# Altium schematic sheet MainBoard_Top.SchDoc
size C
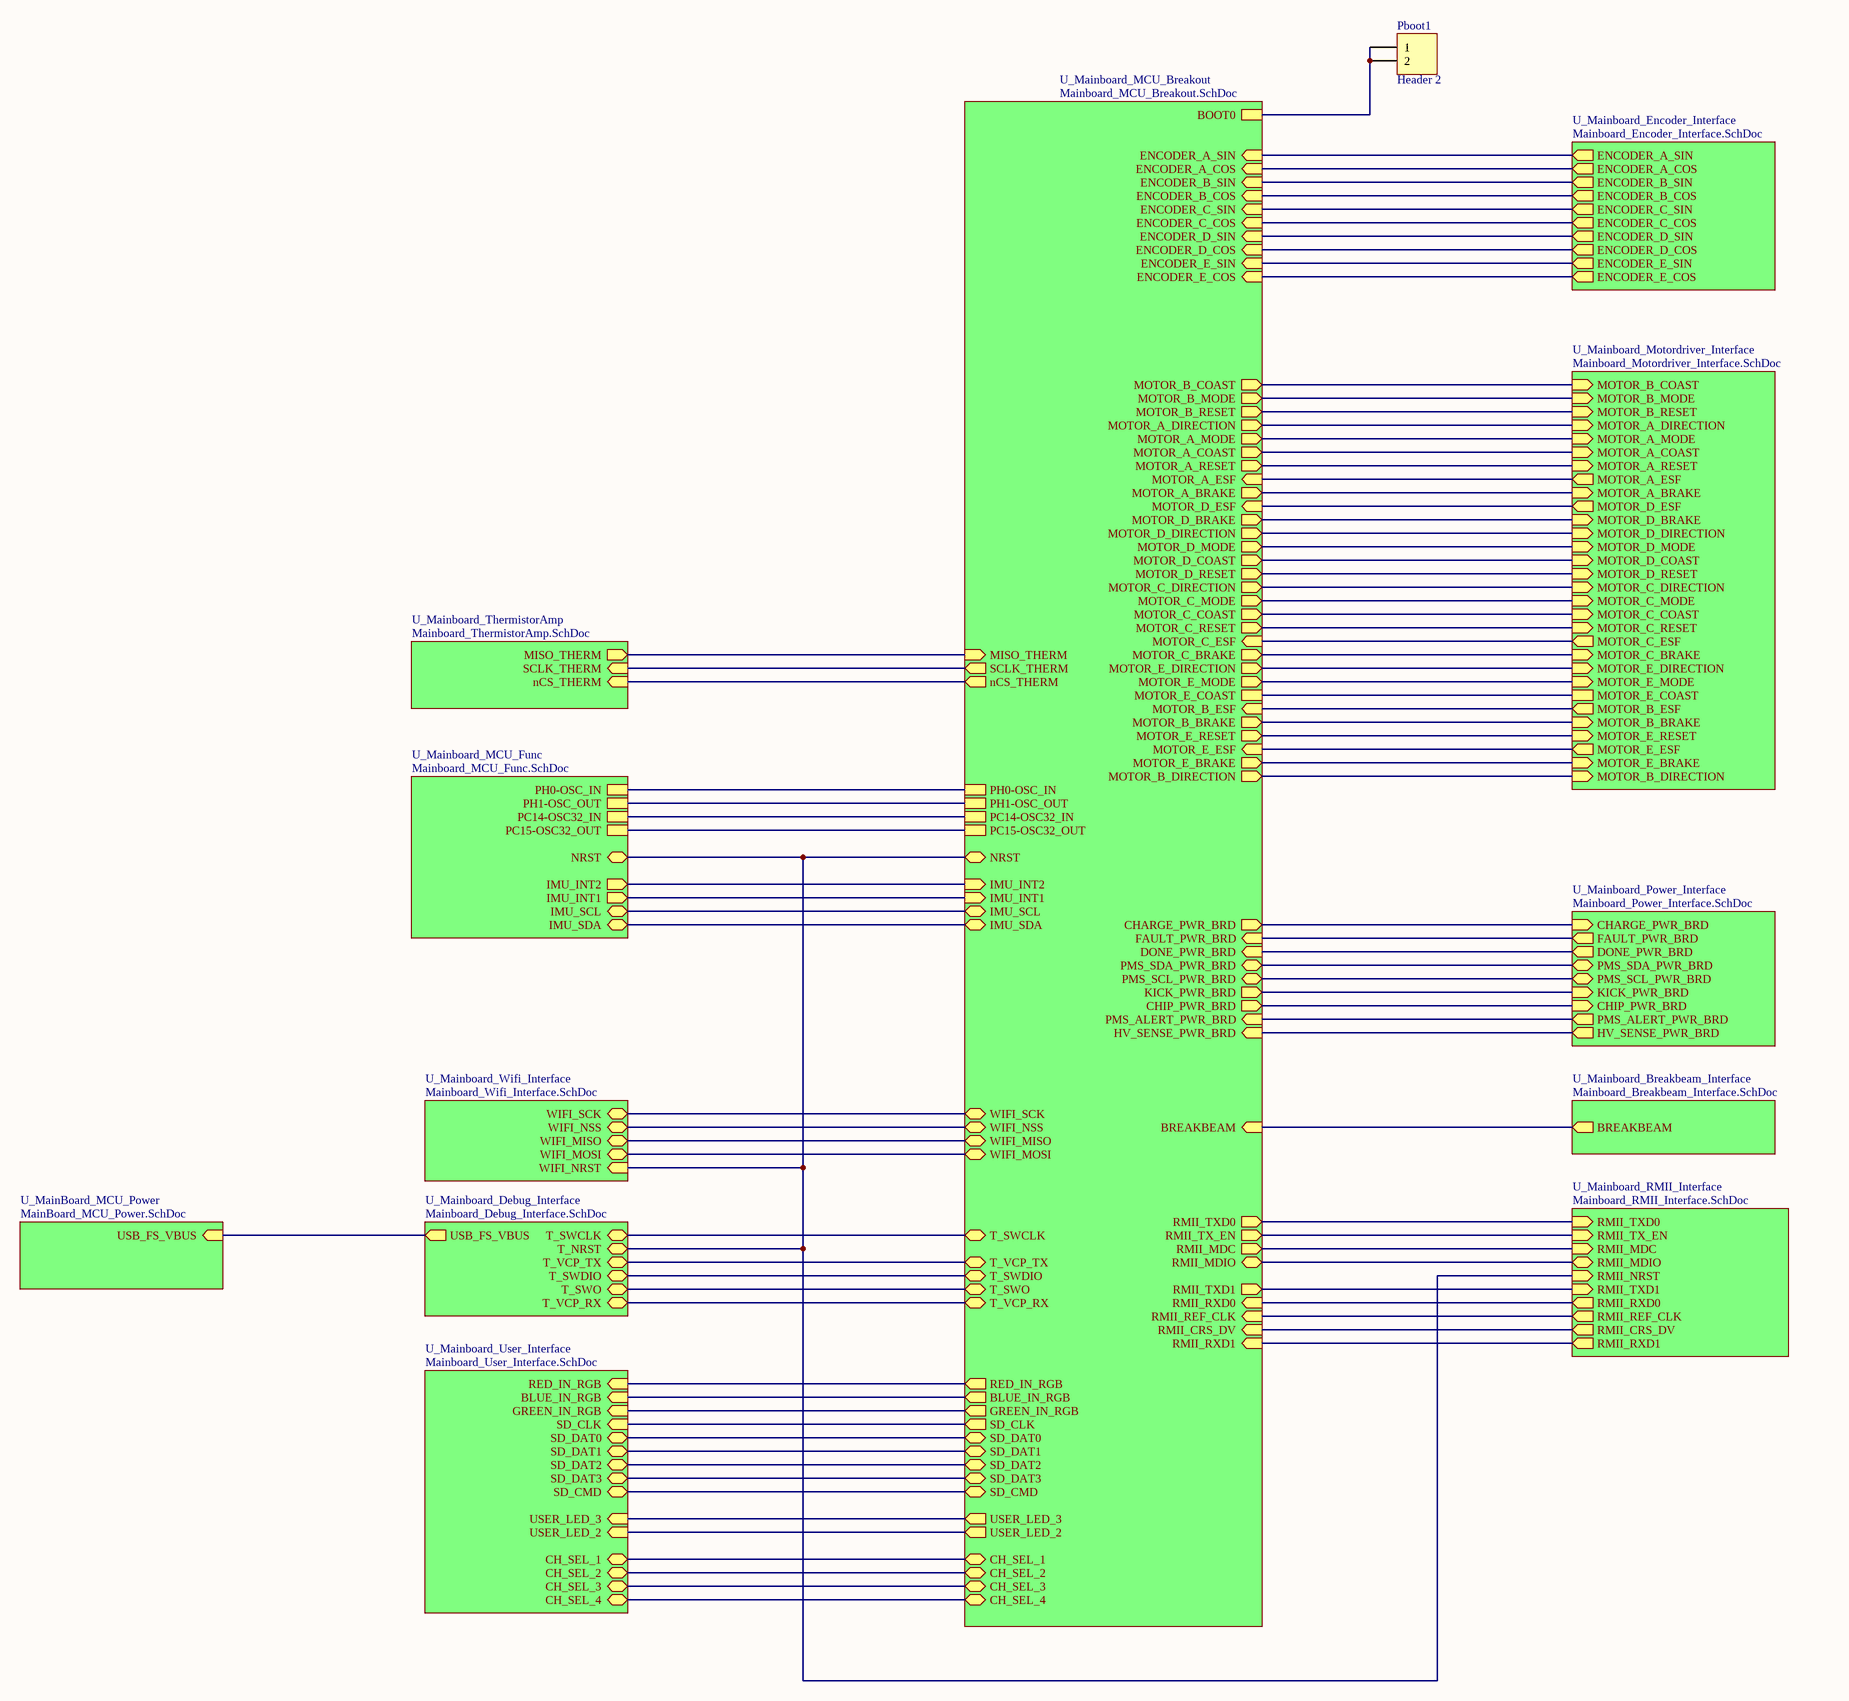
[diagram p0: MainBoard_Top.SchDoc]

## Parts
Pboot1  Header 2  [HDR1X2]

## Sub-sheets
U_Mainboard_Breakbeam_Interface = Mainboard_Breakbeam_Interface.SchDoc: BREAKBEAM (out)
U_Mainboard_Debug_Interface = Mainboard_Debug_Interface.SchDoc: USB_FS_VBUS (out), T_SWCLK (bidir), T_NRST (bidir), T_VCP_TX (bidir), T_SWDIO (bidir), T_SWO (bidir), T_VCP_RX (bidir)
U_Mainboard_Encoder_Interface = Mainboard_Encoder_Interface.SchDoc: ENCODER_A_SIN (out), ENCODER_E_SIN (out), ENCODER_B_COS (out), ENCODER_C_COS (out), ENCODER_A_COS (out), ENCODER_D_SIN (out), ENCODER_D_COS (out), ENCODER_E_COS (out), ENCODER_B_SIN (out), ENCODER_C_SIN (out)
U_Mainboard_MCU_Breakout = Mainboard_MCU_Breakout.SchDoc: BOOT0, T_SWCLK (bidir), T_VCP_TX (bidir), T_SWDIO (bidir), T_SWO (bidir), T_VCP_RX (bidir), RED_IN_RGB (out), BLUE_IN_RGB (out), GREEN_IN_RGB (out), SD_CLK (out), SD_DAT0 (bidir), SD_DAT1 (bidir), SD_DAT2 (bidir), SD_DAT3 (bidir), SD_CMD (bidir), CH_SEL_1 (bidir), CH_SEL_2 (bidir), CH_SEL_3 (bidir), CH_SEL_4 (bidir), ENCODER_A_SIN (in), ENCODER_A_COS (in), ENCODER_B_SIN (in), ENCODER_B_COS (in), ENCODER_C_SIN (in), ENCODER_C_COS (in), ENCODER_D_SIN (in), ENCODER_D_COS (in), ENCODER_E_SIN (in), ENCODER_E_COS (in), USER_LED_3 (out), USER_LED_2 (out), WIFI_MOSI (bidir), WIFI_MISO (bidir), WIFI_NSS (bidir), WIFI_SCK (bidir), PC15-OSC32_OUT, PC14-OSC32_IN, PH1-OSC_OUT, NRST (bidir), PH0-OSC_IN, IMU_INT2 (in), IMU_INT1 (in), BREAKBEAM (in), RMII_TXD0 (out), RMII_TX_EN (out), RMII_MDC (out), RMII_MDIO (bidir), RMII_TXD1 (out), RMII_RXD0 (in), RMII_REF_CLK (in), RMII_CRS_DV (in), RMII_RXD1 (in), HV_SENSE_PWR_BRD (in), PMS_ALERT_PWR_BRD (in), CHIP_PWR_BRD (out), KICK_PWR_BRD (out), PMS_SCL_PWR_BRD (bidir), PMS_SDA_PWR_BRD (bidir), DONE_PWR_BRD (in), FAULT_PWR_BRD (in), CHARGE_PWR_BRD (out), MOTOR_B_COAST (out), MOTOR_B_MODE (out), MOTOR_B_RESET (out), MOTOR_A_DIRECTION (out), MOTOR_A_MODE (out), MOTOR_A_COAST (out), MOTOR_A_RESET (out), MOTOR_A_ESF (in), MOTOR_D_ESF (in), MOTOR_A_BRAKE (out), MOTOR_D_BRAKE (out), MOTOR_D_DIRECTION (out), MOTOR_D_MODE (out), MOTOR_D_COAST (out), MOTOR_D_RESET (out), MOTOR_C_DIRECTION (out), MOTOR_C_MODE (out), MOTOR_C_COAST (out), MOTOR_C_RESET (out), MOTOR_C_ESF (in), MOTOR_C_BRAKE (out), MOTOR_E_DIRECTION (out), MOTOR_E_MODE (out), MOTOR_E_COAST, MOTOR_B_ESF (in), MOTOR_B_BRAKE (out), MOTOR_E_RESET (out), MOTOR_E_ESF (in), MOTOR_E_BRAKE (out), MOTOR_B_DIRECTION (out), IMU_SDA (bidir), IMU_SCL (bidir), nCS_THERM (out), SCLK_THERM (out), MISO_THERM (in)
U_Mainboard_MCU_Func = Mainboard_MCU_Func.SchDoc: NRST (bidir), IMU_SCL (bidir), IMU_SDA (bidir), IMU_INT1 (out), IMU_INT2 (out), PH0-OSC_IN, PH1-OSC_OUT, PC14-OSC32_IN, PC15-OSC32_OUT
U_MainBoard_MCU_Power = MainBoard_MCU_Power.SchDoc: USB_FS_VBUS (in)
U_Mainboard_Motordriver_Interface = Mainboard_Motordriver_Interface.SchDoc: MOTOR_B_COAST (in), MOTOR_B_MODE (in), MOTOR_B_RESET (in), MOTOR_A_DIRECTION (in), MOTOR_A_MODE (in), MOTOR_A_COAST (in), MOTOR_A_RESET (in), MOTOR_A_ESF (out), MOTOR_A_BRAKE (in), MOTOR_D_ESF (out), MOTOR_D_BRAKE (in), MOTOR_D_DIRECTION (in), MOTOR_D_MODE (in), MOTOR_D_COAST (in), MOTOR_D_RESET (in), MOTOR_C_DIRECTION (in), MOTOR_C_MODE (in), MOTOR_C_COAST (in), MOTOR_C_RESET (in), MOTOR_C_ESF (out), MOTOR_C_BRAKE (in), MOTOR_E_DIRECTION (in), MOTOR_E_MODE (in), MOTOR_E_COAST, MOTOR_B_ESF (out), MOTOR_B_BRAKE (in), MOTOR_E_RESET (in), MOTOR_E_ESF (out), MOTOR_E_BRAKE (in), MOTOR_B_DIRECTION (in)
U_Mainboard_Power_Interface = Mainboard_Power_Interface.SchDoc: CHARGE_PWR_BRD (in), FAULT_PWR_BRD (out), DONE_PWR_BRD (out), PMS_SDA_PWR_BRD (bidir), PMS_SCL_PWR_BRD (bidir), KICK_PWR_BRD (in), CHIP_PWR_BRD (in), PMS_ALERT_PWR_BRD (out), HV_SENSE_PWR_BRD (out)
U_Mainboard_RMII_Interface = Mainboard_RMII_Interface.SchDoc: RMII_TXD0 (in), RMII_TX_EN (in), RMII_RXD0 (out), RMII_REF_CLK (out), RMII_CRS_DV (out), RMII_MDC (in), RMII_MDIO (bidir), RMII_NRST (in), RMII_TXD1 (in), RMII_RXD1 (out)
U_Mainboard_ThermistorAmp = Mainboard_ThermistorAmp.SchDoc: nCS_THERM (in), MISO_THERM (out), SCLK_THERM (in)
U_Mainboard_User_Interface = Mainboard_User_Interface.SchDoc: RED_IN_RGB (in), BLUE_IN_RGB (in), GREEN_IN_RGB (in), SD_CLK (in), SD_DAT0 (bidir), SD_DAT1 (bidir), SD_DAT2 (bidir), SD_DAT3 (bidir), SD_CMD (bidir), USER_LED_3 (in), USER_LED_2 (in), CH_SEL_1 (bidir), CH_SEL_2 (bidir), CH_SEL_3 (bidir), CH_SEL_4 (bidir)
U_Mainboard_Wifi_Interface = Mainboard_Wifi_Interface.SchDoc: WIFI_SCK (bidir), WIFI_NSS (bidir), WIFI_MISO (bidir), WIFI_MOSI (bidir), WIFI_NRST (in)

## Nets
NetPboot1_1: Pboot1.1 Pboot1.2 ; sheet U_Mainboard_MCU_Breakout/BOOT0
(unnamed): sheet U_Mainboard_Encoder_Interface/ENCODER_A_SIN, sheet U_Mainboard_MCU_Breakout/ENCODER_A_SIN
(unnamed): sheet U_Mainboard_Encoder_Interface/ENCODER_E_SIN, sheet U_Mainboard_MCU_Breakout/ENCODER_E_SIN
(unnamed): sheet U_Mainboard_Encoder_Interface/ENCODER_B_COS, sheet U_Mainboard_MCU_Breakout/ENCODER_B_COS
(unnamed): sheet U_Mainboard_Encoder_Interface/ENCODER_C_COS, sheet U_Mainboard_MCU_Breakout/ENCODER_C_COS
(unnamed): sheet U_Mainboard_Encoder_Interface/ENCODER_A_COS, sheet U_Mainboard_MCU_Breakout/ENCODER_A_COS
(unnamed): sheet U_Mainboard_Encoder_Interface/ENCODER_D_SIN, sheet U_Mainboard_MCU_Breakout/ENCODER_D_SIN
(unnamed): sheet U_Mainboard_Encoder_Interface/ENCODER_D_COS, sheet U_Mainboard_MCU_Breakout/ENCODER_D_COS
(unnamed): sheet U_Mainboard_Encoder_Interface/ENCODER_E_COS, sheet U_Mainboard_MCU_Breakout/ENCODER_E_COS
(unnamed): sheet U_Mainboard_Encoder_Interface/ENCODER_B_SIN, sheet U_Mainboard_MCU_Breakout/ENCODER_B_SIN
(unnamed): sheet U_Mainboard_Encoder_Interface/ENCODER_C_SIN, sheet U_Mainboard_MCU_Breakout/ENCODER_C_SIN
(unnamed): sheet U_Mainboard_Motordriver_Interface/MOTOR_B_COAST, sheet U_Mainboard_MCU_Breakout/MOTOR_B_COAST
(unnamed): sheet U_Mainboard_Motordriver_Interface/MOTOR_B_MODE, sheet U_Mainboard_MCU_Breakout/MOTOR_B_MODE
(unnamed): sheet U_Mainboard_Motordriver_Interface/MOTOR_B_RESET, sheet U_Mainboard_MCU_Breakout/MOTOR_B_RESET
(unnamed): sheet U_Mainboard_Motordriver_Interface/MOTOR_A_DIRECTION, sheet U_Mainboard_MCU_Breakout/MOTOR_A_DIRECTION
(unnamed): sheet U_Mainboard_Motordriver_Interface/MOTOR_A_MODE, sheet U_Mainboard_MCU_Breakout/MOTOR_A_MODE
(unnamed): sheet U_Mainboard_Motordriver_Interface/MOTOR_A_COAST, sheet U_Mainboard_MCU_Breakout/MOTOR_A_COAST
(unnamed): sheet U_Mainboard_Motordriver_Interface/MOTOR_A_RESET, sheet U_Mainboard_MCU_Breakout/MOTOR_A_RESET
(unnamed): sheet U_Mainboard_Motordriver_Interface/MOTOR_A_ESF, sheet U_Mainboard_MCU_Breakout/MOTOR_A_ESF
(unnamed): sheet U_Mainboard_Motordriver_Interface/MOTOR_A_BRAKE, sheet U_Mainboard_MCU_Breakout/MOTOR_A_BRAKE
(unnamed): sheet U_Mainboard_Motordriver_Interface/MOTOR_D_ESF, sheet U_Mainboard_MCU_Breakout/MOTOR_D_ESF
(unnamed): sheet U_Mainboard_Motordriver_Interface/MOTOR_D_BRAKE, sheet U_Mainboard_MCU_Breakout/MOTOR_D_BRAKE
(unnamed): sheet U_Mainboard_Motordriver_Interface/MOTOR_D_DIRECTION, sheet U_Mainboard_MCU_Breakout/MOTOR_D_DIRECTION
(unnamed): sheet U_Mainboard_Motordriver_Interface/MOTOR_D_MODE, sheet U_Mainboard_MCU_Breakout/MOTOR_D_MODE
(unnamed): sheet U_Mainboard_Motordriver_Interface/MOTOR_D_COAST, sheet U_Mainboard_MCU_Breakout/MOTOR_D_COAST
(unnamed): sheet U_Mainboard_Motordriver_Interface/MOTOR_D_RESET, sheet U_Mainboard_MCU_Breakout/MOTOR_D_RESET
(unnamed): sheet U_Mainboard_Motordriver_Interface/MOTOR_C_DIRECTION, sheet U_Mainboard_MCU_Breakout/MOTOR_C_DIRECTION
(unnamed): sheet U_Mainboard_Motordriver_Interface/MOTOR_C_MODE, sheet U_Mainboard_MCU_Breakout/MOTOR_C_MODE
(unnamed): sheet U_Mainboard_Motordriver_Interface/MOTOR_C_COAST, sheet U_Mainboard_MCU_Breakout/MOTOR_C_COAST
(unnamed): sheet U_Mainboard_Motordriver_Interface/MOTOR_C_RESET, sheet U_Mainboard_MCU_Breakout/MOTOR_C_RESET
(unnamed): sheet U_Mainboard_Motordriver_Interface/MOTOR_C_ESF, sheet U_Mainboard_MCU_Breakout/MOTOR_C_ESF
(unnamed): sheet U_Mainboard_Motordriver_Interface/MOTOR_C_BRAKE, sheet U_Mainboard_MCU_Breakout/MOTOR_C_BRAKE
(unnamed): sheet U_Mainboard_Motordriver_Interface/MOTOR_E_DIRECTION, sheet U_Mainboard_MCU_Breakout/MOTOR_E_DIRECTION
(unnamed): sheet U_Mainboard_Motordriver_Interface/MOTOR_E_MODE, sheet U_Mainboard_MCU_Breakout/MOTOR_E_MODE
(unnamed): sheet U_Mainboard_Motordriver_Interface/MOTOR_E_COAST, sheet U_Mainboard_MCU_Breakout/MOTOR_E_COAST
(unnamed): sheet U_Mainboard_Motordriver_Interface/MOTOR_B_ESF, sheet U_Mainboard_MCU_Breakout/MOTOR_B_ESF
(unnamed): sheet U_Mainboard_Motordriver_Interface/MOTOR_B_BRAKE, sheet U_Mainboard_MCU_Breakout/MOTOR_B_BRAKE
(unnamed): sheet U_Mainboard_Motordriver_Interface/MOTOR_E_RESET, sheet U_Mainboard_MCU_Breakout/MOTOR_E_RESET
(unnamed): sheet U_Mainboard_Motordriver_Interface/MOTOR_E_ESF, sheet U_Mainboard_MCU_Breakout/MOTOR_E_ESF
(unnamed): sheet U_Mainboard_Motordriver_Interface/MOTOR_E_BRAKE, sheet U_Mainboard_MCU_Breakout/MOTOR_E_BRAKE
(unnamed): sheet U_Mainboard_Motordriver_Interface/MOTOR_B_DIRECTION, sheet U_Mainboard_MCU_Breakout/MOTOR_B_DIRECTION
(unnamed): sheet U_Mainboard_Power_Interface/CHARGE_PWR_BRD, sheet U_Mainboard_MCU_Breakout/CHARGE_PWR_BRD
(unnamed): sheet U_Mainboard_Power_Interface/FAULT_PWR_BRD, sheet U_Mainboard_MCU_Breakout/FAULT_PWR_BRD
(unnamed): sheet U_Mainboard_Power_Interface/DONE_PWR_BRD, sheet U_Mainboard_MCU_Breakout/DONE_PWR_BRD
(unnamed): sheet U_Mainboard_Power_Interface/PMS_SDA_PWR_BRD, sheet U_Mainboard_MCU_Breakout/PMS_SDA_PWR_BRD
(unnamed): sheet U_Mainboard_Power_Interface/PMS_SCL_PWR_BRD, sheet U_Mainboard_MCU_Breakout/PMS_SCL_PWR_BRD
(unnamed): sheet U_Mainboard_Power_Interface/KICK_PWR_BRD, sheet U_Mainboard_MCU_Breakout/KICK_PWR_BRD
(unnamed): sheet U_Mainboard_Power_Interface/CHIP_PWR_BRD, sheet U_Mainboard_MCU_Breakout/CHIP_PWR_BRD
(unnamed): sheet U_Mainboard_Power_Interface/PMS_ALERT_PWR_BRD, sheet U_Mainboard_MCU_Breakout/PMS_ALERT_PWR_BRD
(unnamed): sheet U_Mainboard_Power_Interface/HV_SENSE_PWR_BRD, sheet U_Mainboard_MCU_Breakout/HV_SENSE_PWR_BRD
(unnamed): sheet U_Mainboard_RMII_Interface/RMII_TXD0, sheet U_Mainboard_MCU_Breakout/RMII_TXD0
(unnamed): sheet U_Mainboard_RMII_Interface/RMII_TX_EN, sheet U_Mainboard_MCU_Breakout/RMII_TX_EN
(unnamed): sheet U_Mainboard_RMII_Interface/RMII_RXD0, sheet U_Mainboard_MCU_Breakout/RMII_RXD0
(unnamed): sheet U_Mainboard_RMII_Interface/RMII_REF_CLK, sheet U_Mainboard_MCU_Breakout/RMII_REF_CLK
(unnamed): sheet U_Mainboard_RMII_Interface/RMII_CRS_DV, sheet U_Mainboard_MCU_Breakout/RMII_CRS_DV
(unnamed): sheet U_Mainboard_RMII_Interface/RMII_MDC, sheet U_Mainboard_MCU_Breakout/RMII_MDC
(unnamed): sheet U_Mainboard_RMII_Interface/RMII_MDIO, sheet U_Mainboard_MCU_Breakout/RMII_MDIO
(unnamed): sheet U_Mainboard_RMII_Interface/RMII_NRST, sheet U_Mainboard_Wifi_Interface/WIFI_NRST, sheet U_Mainboard_Debug_Interface/T_NRST, sheet U_Mainboard_MCU_Breakout/NRST, sheet U_Mainboard_MCU_Func/NRST
(unnamed): sheet U_Mainboard_RMII_Interface/RMII_TXD1, sheet U_Mainboard_MCU_Breakout/RMII_TXD1
(unnamed): sheet U_Mainboard_RMII_Interface/RMII_RXD1, sheet U_Mainboard_MCU_Breakout/RMII_RXD1
(unnamed): sheet U_Mainboard_Wifi_Interface/WIFI_SCK, sheet U_Mainboard_MCU_Breakout/WIFI_SCK
(unnamed): sheet U_Mainboard_Wifi_Interface/WIFI_NSS, sheet U_Mainboard_MCU_Breakout/WIFI_NSS
(unnamed): sheet U_Mainboard_Wifi_Interface/WIFI_MISO, sheet U_Mainboard_MCU_Breakout/WIFI_MISO
(unnamed): sheet U_Mainboard_Wifi_Interface/WIFI_MOSI, sheet U_Mainboard_MCU_Breakout/WIFI_MOSI
(unnamed): sheet U_Mainboard_Breakbeam_Interface/BREAKBEAM, sheet U_Mainboard_MCU_Breakout/BREAKBEAM
(unnamed): sheet U_MainBoard_MCU_Power/USB_FS_VBUS, sheet U_Mainboard_Debug_Interface/USB_FS_VBUS
(unnamed): sheet U_Mainboard_Debug_Interface/T_SWCLK, sheet U_Mainboard_MCU_Breakout/T_SWCLK
(unnamed): sheet U_Mainboard_Debug_Interface/T_VCP_TX, sheet U_Mainboard_MCU_Breakout/T_VCP_TX
(unnamed): sheet U_Mainboard_Debug_Interface/T_SWDIO, sheet U_Mainboard_MCU_Breakout/T_SWDIO
(unnamed): sheet U_Mainboard_Debug_Interface/T_SWO, sheet U_Mainboard_MCU_Breakout/T_SWO
(unnamed): sheet U_Mainboard_Debug_Interface/T_VCP_RX, sheet U_Mainboard_MCU_Breakout/T_VCP_RX
(unnamed): sheet U_Mainboard_User_Interface/RED_IN_RGB, sheet U_Mainboard_MCU_Breakout/RED_IN_RGB
(unnamed): sheet U_Mainboard_User_Interface/BLUE_IN_RGB, sheet U_Mainboard_MCU_Breakout/BLUE_IN_RGB
(unnamed): sheet U_Mainboard_User_Interface/GREEN_IN_RGB, sheet U_Mainboard_MCU_Breakout/GREEN_IN_RGB
(unnamed): sheet U_Mainboard_User_Interface/SD_CLK, sheet U_Mainboard_MCU_Breakout/SD_CLK
(unnamed): sheet U_Mainboard_User_Interface/SD_DAT0, sheet U_Mainboard_MCU_Breakout/SD_DAT0
(unnamed): sheet U_Mainboard_User_Interface/SD_DAT1, sheet U_Mainboard_MCU_Breakout/SD_DAT1
(unnamed): sheet U_Mainboard_User_Interface/SD_DAT2, sheet U_Mainboard_MCU_Breakout/SD_DAT2
(unnamed): sheet U_Mainboard_User_Interface/SD_DAT3, sheet U_Mainboard_MCU_Breakout/SD_DAT3
(unnamed): sheet U_Mainboard_User_Interface/SD_CMD, sheet U_Mainboard_MCU_Breakout/SD_CMD
(unnamed): sheet U_Mainboard_User_Interface/USER_LED_3, sheet U_Mainboard_MCU_Breakout/USER_LED_3
(unnamed): sheet U_Mainboard_User_Interface/USER_LED_2, sheet U_Mainboard_MCU_Breakout/USER_LED_2
(unnamed): sheet U_Mainboard_User_Interface/CH_SEL_1, sheet U_Mainboard_MCU_Breakout/CH_SEL_1
(unnamed): sheet U_Mainboard_User_Interface/CH_SEL_2, sheet U_Mainboard_MCU_Breakout/CH_SEL_2
(unnamed): sheet U_Mainboard_User_Interface/CH_SEL_3, sheet U_Mainboard_MCU_Breakout/CH_SEL_3
(unnamed): sheet U_Mainboard_User_Interface/CH_SEL_4, sheet U_Mainboard_MCU_Breakout/CH_SEL_4
(unnamed): sheet U_Mainboard_MCU_Breakout/PC15-OSC32_OUT, sheet U_Mainboard_MCU_Func/PC15-OSC32_OUT
(unnamed): sheet U_Mainboard_MCU_Breakout/PC14-OSC32_IN, sheet U_Mainboard_MCU_Func/PC14-OSC32_IN
(unnamed): sheet U_Mainboard_MCU_Breakout/PH1-OSC_OUT, sheet U_Mainboard_MCU_Func/PH1-OSC_OUT
(unnamed): sheet U_Mainboard_MCU_Breakout/PH0-OSC_IN, sheet U_Mainboard_MCU_Func/PH0-OSC_IN
(unnamed): sheet U_Mainboard_MCU_Breakout/IMU_INT2, sheet U_Mainboard_MCU_Func/IMU_INT2
(unnamed): sheet U_Mainboard_MCU_Breakout/IMU_INT1, sheet U_Mainboard_MCU_Func/IMU_INT1
(unnamed): sheet U_Mainboard_MCU_Breakout/IMU_SDA, sheet U_Mainboard_MCU_Func/IMU_SDA
(unnamed): sheet U_Mainboard_MCU_Breakout/IMU_SCL, sheet U_Mainboard_MCU_Func/IMU_SCL
(unnamed): sheet U_Mainboard_MCU_Breakout/nCS_THERM, sheet U_Mainboard_ThermistorAmp/nCS_THERM
(unnamed): sheet U_Mainboard_MCU_Breakout/SCLK_THERM, sheet U_Mainboard_ThermistorAmp/SCLK_THERM
(unnamed): sheet U_Mainboard_MCU_Breakout/MISO_THERM, sheet U_Mainboard_ThermistorAmp/MISO_THERM

## Library data of the parts
Pboot1 = Header 2: Header, 2-Pin; LatestRevisionDate: 17-Jul-2002; LatestRevisionNote: Re-released for DXP Platform.; Publisher: Altium Limited